# Altium schematic sheet RTM_IPMI.SchDoc: Sayma RTM
size 420 x 297 mm; $$Internal___BlkDate: 23:43:25_12-13-18; $$Internal_NAME_PLACEHOLDER: a3sheet; $$Internal_Resolution: 00001mm; $$NotCommonProperty_@NAME: RTM_IPMI; $$NotCommonProperty_@PRINTORDER: 15; $$NotCommonProperty_@SHEET: 1; $$NotCommonProperty_@SHEETTOTAL: 16; CmpIndex: 4; Drawing Author: G.Kasprowicz; Drawing Number: Sayma RTM; Drawing Project: 8 channel SAWG; Drawing Revision: 2.0; SymIndex: 2227; Author: G.Kasprowicz; CompanyName: WUT ISE; DrawnBy: G.Kasprowicz; Organization: WUT ISE; Address1: PW ISE; Address2: Nowowiejska 15/19 00-665 Warsaw; Address3: gkasprow@gmail.com; DocumentNumber: 17; Revision: 1.0; SheetNumber: 17; SheetTotal: 18; ModifiedBy: -; CheckedDate: -; Title2: RTM IPMI; DivGrp: WUT ISE; Designer: G.Kasprowicz; ModifiedDate: -; ProjectName: Sensor Box
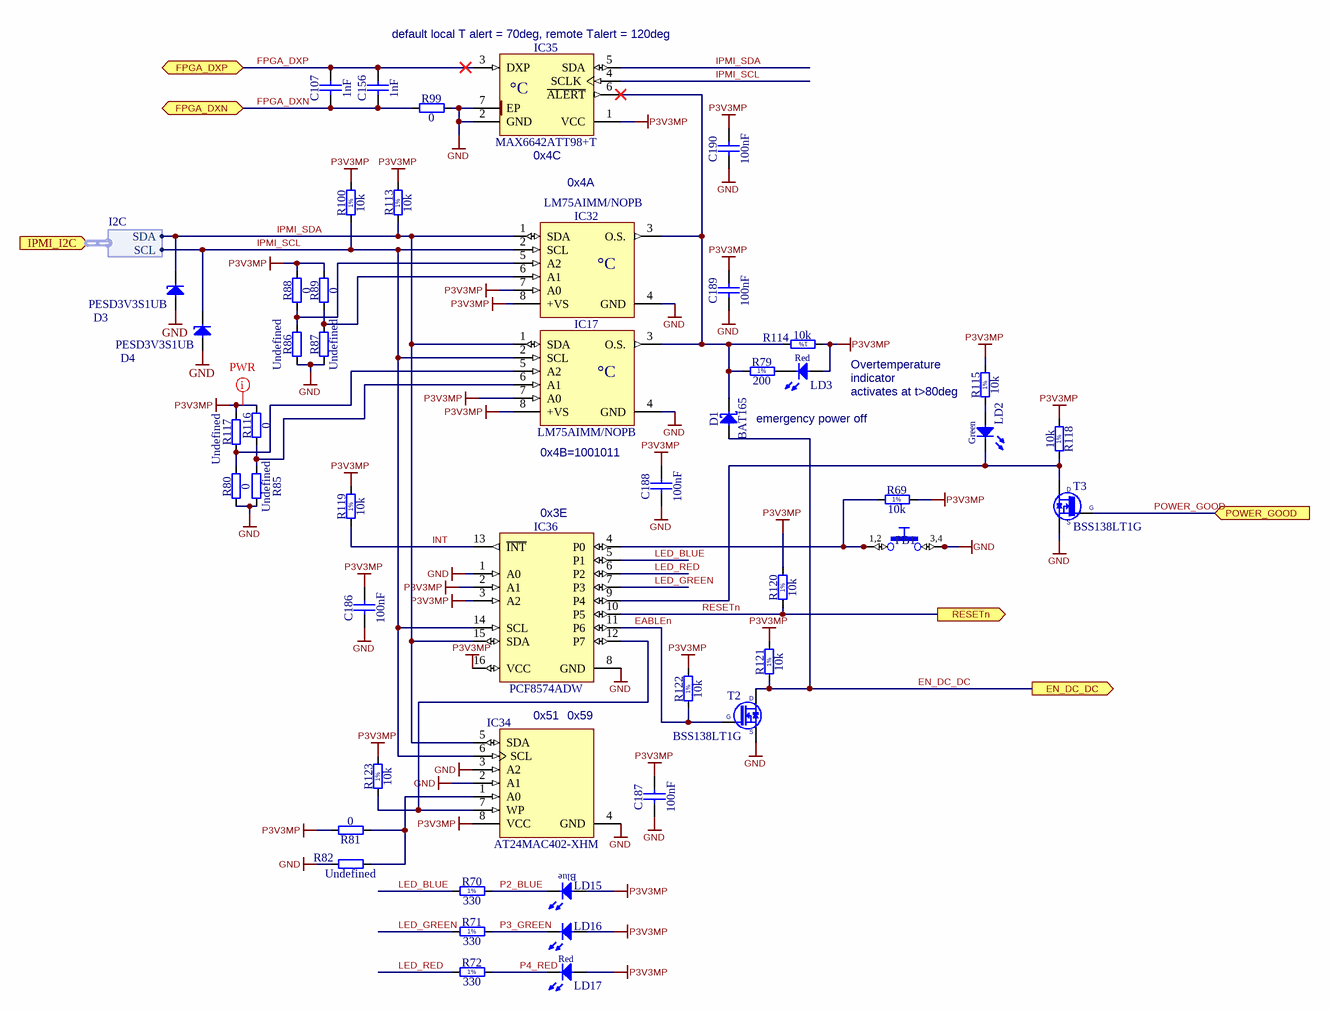
[diagram p0: RTM_IPMI.SchDoc]

## Parts
C107  1nF  [CAPC1005X55N]
C156  1nF  [CAPC1005X55N]
C186  100nF  [CAPC0603X33N]
C187  100nF  [CAPC0603X33N]
C188  100nF  [CAPC0603X33N]
C189  100nF  [CAPC0603X33N]
C190  100nF  [CAPC0603X33N]
D1  BAT165  [SOD2512X110N]
D3  PESD3V3S1UB  [SODFL1608X65N]
D4  PESD3V3S1UB  [SODFL1608X65N]
IC17  LM75AIMM/NOPB  [SOP65P490X109-8N]
IC32  LM75AIMM/NOPB  [SOP65P490X109-8N]
IC34  AT24MAC402-XHM  [SOP65P640X120-8N]
IC35  MAX6642ATT98+T  [SON95P300X300X80-7N-R160X240]
IC36  PCF8574ADW  [SOIC127P1030X265-16N]
LD2  Green  [LED_KINGBRIGHT_KPH-1608CGCK]
LD3  Red  [LED_KINGBRIGHT_KPH-1608SURCK]
LD15  Blue  [LED_AVAGO_HSMR-C120]  (value not drawn)
LD16  Green  [LED_AVAGO_HSME-C120]  (value not drawn)
LD17  Red  [LED_KINGBRIGHT_KPH-1608SURCK]
PB1  Push Button  [SW_C&K_HDT0001]  (value not drawn)
R69  10k  [RESC1005X40N]
R70  330  [RESC1005X40N]
R71  330  [RESC1005X40N]
R72  330  [RESC1005X40N]
R79  200  [RESC1005X40N]
R80  0  [RESC1005X40N]
R81  0  [RESC1005X40N]
R82  Undefined  [RESC1005X40N]
R85  Undefined  [RESC1005X40N]
R86  Undefined  [RESC1005X40N]
R87  Undefined  [RESC1005X40N]
R88  0  [RESC1005X40N]
R89  0  [RESC1005X40N]
R99  0  [RESC1005X40N]
R100  10k  [RESC1005X40N]
R113  10k  [RESC1005X40N]
R114  10k  [RESC1005X40N]
R115  10k  [RESC1005X40N]
R116  0  [RESC1005X40N]
R117  Undefined  [RESC1005X40N]
R118  10k  [RESC1005X40N]
R119  10k  [RESC1005X40N]
R120  10k  [RESC1005X40N]
R121  10k  [RESC1005X40N]
R122  10k  [RESC1005X40N]
R123  10k  [RESC1005X40N]
T2  BSS138LT1G  [SOT95P240X110-3N]
T3  BSS138LT1G  [SOT95P240X110-3N]

## Ports
EN_DC_DC (out), FPGA_DXN (bidir), FPGA_DXP (bidir), IPMI_I2C (in, harness I2C), POWER_GOOD (in), RESETn (out)

## Harnesses
I2C: SCL, SDA

## Nets
GND: C186.1 C187.1 C188.1 C189.1 C190.1 D3.2(A) D4.2(A) IC17.4(GND) IC32.4(GND) IC34.2(A1) IC34.3(A2) IC34.4(GND) IC35.2(GND) IC35.7(EP) IC36.1(A0) IC36.8(GND) PB1.3 PB1.4 R80.1 R82.1 R85.1 R86.1 R87.1 R99.2 T2.2(S) T3.2(S)
P3V3MP: C186.2 C187.2 C188.2 C189.2 C190.2 IC17.7(A0) IC17.8(+VS) IC32.7(A0) IC32.8(+VS) IC34.8(VCC) IC35.1(VCC) IC36.2(A1) IC36.3(A2) IC36.16(VCC) LD3.2(A) LD15.2(A) LD16.2(A) LD17.2(A) R69.2 R81.2 R88.2 R89.2 R100.2 R113.2 R114.1 R115.2 R116.2 R117.2 R118.2 R119.2 R120.2 R121.2 R122.2 R123.2
EABLEn: IC36.11(P6) R122.1 T2.1(G)
EN_DC_DC: D1.2(A) R121.1 T2.3(D) ; port EN_DC_DC
FPGA_DXN: C107.1 C156.1 R99.1 ; port FPGA_DXN
FPGA_DXP: C107.2 C156.2 IC35.3(DXP) ; port FPGA_DXP
INT: IC36.13(~{INT}) R119.1
IPMI_SCL: D4.1(C) IC17.2(SCL) IC32.2(SCL) IC34.6(SCL) IC35.4(SCLK) IC36.14(SCL) R100.1 ; port IPMI_I2C.SCL
IPMI_SDA: D3.1(C) IC17.1(SDA) IC32.1(SDA) IC34.5(SDA) IC35.5(SDA) IC36.15(SDA) R113.1 ; port IPMI_I2C.SDA
LED_BLUE: IC36.5(P1) R70.1
LED_GREEN: IC36.7(P3) R71.1
LED_RED: IC36.6(P2) R72.1
P2_BLUE: LD15.1(C) R70.2
P3_GREEN: LD16.1(C) R71.2
P4_RED: LD17.1(C) R72.2
POWER_GOOD: T3.1(G) ; port POWER_GOOD
RESETn: IC36.10(P5) R120.1 ; port RESETn
NetD1_1: D1.1(C) IC17.3(O.S.) IC32.3(O.S.) IC35.6(~{ALERT}) R79.1 R114.2
NetIC17_5: IC17.5(A2) R80.2 R117.1
NetIC17_6: IC17.6(A1) R85.2 R116.1
NetIC32_5: IC32.5(A2) R86.2 R88.1
NetIC32_6: IC32.6(A1) R87.2 R89.1
NetIC34_1: IC34.1(A0) R81.1 R82.2
NetIC34_7: IC34.7(WP) IC36.12(P7) R123.1
NetIC36_4: IC36.4(P0) PB1.1 PB1.2 R69.1
NetIC36_9: IC36.9(P4) LD2.1(C) R118.1 T3.3(D)
NetLD2_2: LD2.2(A) R115.1
NetLD3_1: LD3.1(C) R79.2

## Layout directives
net class PWR: P3V3MP

## Notes on the sheet
- default local T alert = 70deg, remote Talert = 120deg
- (near IC35) 0x4C
- 0x4A
- Overtemperature
- indicator
- 0x4B=1001011
- emergency power off
- (near R115) activates at t>80deg
- (near IC36) 0x3E
- (near IC34) 0x51
- (near IC34) 0x59
- Project/Equipment
- Document
- Designer
- Drawn by
- Check.by
- Copyright WUT ISE 2018.
  This documentation describes Open Hardware and is licensed under the CERN OHL v.1.1. You may redistribute and modify this documentation under the terms of the CERN OHL v.1.1. (http://ohwr.org/CERNOHL). This documentation is distributed WITHOUT ANY EXPRESS OR IMPLIED WARRANTY, INCLUDING OF MERCHANTABILITY, SATISFACTORY QUALITY AND FITNESS FOR A PARTICULAR PURPOSE. Please see the CERN OHL v.1.1 for applicable conditions.
- Contact
- File
- Last Mod.
- Print Date
- Sheet
- Size
- A3
- of
- Rev
- (in symbol LM75AIMM/NOPB) °C
- (in symbol MAX6642ATT98+T) °C
- (in symbol R0402_10K_1%_0.0625W_100PPM) 1%
- (in symbol R0402_200R_1%_0.0625W_100PPM) 1%
- (in symbol R0402_330R_1%_0.0625W_100PPM) 1%
- (in symbol SW_C&K_HDT0001) 1,2; 3,4

## Library data of the parts
C107 C156 = CC0402_1NF_50V_10%_X7R: Non-polarised capacitor; Manufacturer: GENERIC; Part Description: SMD Multilayer Chip Ceramic Capacitor; Manufacturer1 Part Number: 223858715623; Tolerance: ±10%; Voltage: 50V; TC: X7R; Manufacturer Part Number: CC0402_1NF_50V_10%_X7R; Part Number: CC0402_1NF_50V_10%_X7R; Value: 1nF; Component Kind: Standard; Component Type: Standard; Pin Count: 2; Status: Not Recommended; Case: 0402; Mounted: Yes; Socket: No; SMD: Yes; Sense: No; Manufacturer1 Example: PHYCOMP; Manufacturer1 ComponentHeight: 0.55mm; HelpURL: \\cern.ch\dfs\Applications\Altium\Datasheets\CC0402_X7R_PHYCOMP.pdf; Author: CERN DEM JLC; CreateDate: 03.12.2007; LatestRevisionDate: 03.12.2007
C186-C190 = CC0201_100NF_6.3V_10%_X5R: Non-polarised capacitor; Manufacturer: GENERIC; Manufacturer1 Part Number: 02016D104KAT2A; Part Description: SMD Multilayer Chip Ceramic Capacitor; TC: X5R; Tolerance: ±10%; Voltage: 6.3V; Case: 0201; Manufacturer Part Number: CC0201_100NF_6.3V_10%_X5R; Manufacturer1 Example: AVX; Part Number: CC0201_100NF_6.3V_10%_X5R; Pin Count: 2; SMD: Yes; Status: Not Recommended; Value: 100nF; Component Kind: Standard; Component Type: Standard; Mounted: Yes; Socket: No; Sense: No; Manufacturer1 ComponentHeight: 0.33mm; HelpURL: \\cern.ch\dfs\Applications\Altium\Datasheets\CC0201_X5R_AVX.pdf; Author: CERN DEM JLC; CreateDate: 03.12.2007; LatestRevisionDate: 03.12.2007
D1 = BAT165: Schottky Diode; Manufacturer: INFINEON; Part Description: Medium Power AF Schottky Diode; Bonding: No; Power: 750mA; PressFit: No; Voltage: 40V; Case: SOD323; ComponentHeight: 1.1mm; Device: BAT165; Manufacturer Part Number: BAT165; Mounted: Yes; PackageDescription: Small Outline Diode (SOD-323), 1.70mm W X 1.25mm L X 1.10mm H body,  IPC Medium Density; Part Number: BAT165; Pin Count: 2; Sense: No; SMD: Yes; Socket: No; Component Kind: Standard; Component Type: Standard; HelpURL: \\cern.ch\dfs\Applications\Altium\Datasheets\BAT165.pdf; Author: CERN DEM JLC; CreateDate: 12.11.2014; LatestRevisionDate: 12.11.2014
D3 D4 = PESD3V3S1UB: ESD protection diode; Manufacturer: NXP SEMICONDUCTORS; Part Description: ESD protection diode (23kV); Voltage: 3V3; Power: 330W; PressFit: No; Bonding: No; Manufacturer Part Number: PESD3V3S1UB; PackageDescription: Ultra Small Outline Diode Flat Lead (SOD-523), Body; 1.2mm L X 0.8mm W X 0.65mm H, IPC Medium Density; Part Number: PESD3V3S1UB; Component Kind: Standard; Component Type: Standard; Device: PESD3V3S1UB; Pin Count: 2; Case: SOD523; Mounted: Yes; Socket: No; SMD: Yes; Sense: No; ComponentHeight: 0.65mm; HelpURL: \\cern.ch\dfs\Applications\Altium\Datasheets\PESD3V3S1UB.pdf; Author: CERN DEM JLC; CreateDate: 29.11.2012; LatestRevisionDate: 29.11.2012
IC17 IC32 = LM75AIMM/NOPB: Digital Temperature Sensor and Thermal Watchdog with Two-Wire Interface; Manufacturer: TEXAS INSTRUMENTS; Part Description: -25° to +100°C ±2°C Digital Temperature Sensor and Thermal Watchdog with Two-Wire Interface; Bonding: No; PressFit: No; Case: SSOP8; ComponentHeight: 1.09mm; Device: LM75AIMM/NOPB; Manufacturer Part Number: LM75AIMM/NOPB; Mounted: Yes; PackageDescription: SOP, 0.65mm pitch; 8 pin,3.00mm W X 3.00mm L X 1.09mm H bodyI, PC Medium Density; Part Number: LM75AIMM/NOPB; Pin Count: 8; Sense: No; SMD: Yes; Socket: No; Component Kind: Standard; Component Type: Standard; HelpURL: \\cern.ch\dfs\Applications\Altium\Datasheets\LM75AIMM-NOPB.pdf; Author: CERN DEM JLC; CreateDate: 15.10.2012; LatestRevisionDate: 15.10.2012
IC34 = AT24MAC402-XHM: 1.7V to 5.5V, I2C-Compatible (2-wire) 2-Kbit (256 x 8) Serial EEPROM; Manufacturer: ATMEL; Part Description: 1.7V to 5.5V, I2C-Compatible (2-wire) 2-Kbit (256 x 8) Serial EEPROM with a EUI-48 Address; Bonding: No; PressFit: No; Author: CERN DEM MR; Case: TSSOP8; Component Kind: Standard; Component Type: Standard; ComponentHeight: 1.2mm; CreateDate: 09.03.2016; Device: AT24MAC402-XHM; Footprint: SOP65X640X120-8N; HelpURL: \\cern.ch\dfs\Applications\Altium\Datasheets\AT24MAC402-XHM.pdf; LatestRevisionDate: 09.11.2016; Manufacturer Part Number: AT24MAC402-XHM; Mounted: Yes; PackageDescription: SOP, 0.65mm pitch; 8 pin, 4.40mm W X 3.00mm L X 1.20mm H body, IPC Medium Density; Part Number: AT24MAC402-XHM; Pin Count: 8; Sense: No; SMD: Yes; Socket: No
IC35 = MAX6642ATT98+T: ±1°C, SMBus-Compatible Remote/Local Temperature Sensor with Overtemperature Alarm; Manufacturer: MAXIM; Part Description: 0°C to +125°C, ±1°C, SMBus-Compatible Remote/Local Temperature Sensor with Overtemperature Alarm (Address 1001 100); Bonding: No; PressFit: No; Case: SON6; ComponentHeight: 0.8mm; Device: MAX6642ATT98+T; Manufacturer Part Number: MAX6642ATT98+T; Mounted: Yes; PackageDescription: SON, 0.95mm Pitch; 6 Pin, 3.00mm W X 3mm L X 0.80mm H body (w/Thermal Tab 1.6mm x 2.4mm); Part Number: MAX6642ATT98+T; Pin Count: 7; Sense: No; SMD: Yes; Socket: No; Component Kind: Standard; Component Type: Standard; HelpURL: \\cern.ch\dfs\Applications\Altium\Datasheets\MAX6642ATT98+T.pdf; Author: CERN DEM JLC; CreateDate: 26.11.2013; LatestRevisionDate: 26.11.2013
IC36 = PCF8574ADW: Remote 8-bit I/O Expander For I2C Bus; Manufacturer: TEXAS INSTRUMENTS; Bonding: No; PressFit: No; Case: SOIC16W; ComponentHeight: 2.65mm; Device: PCF8574ADW; Manufacturer Part Number: PCF8574ADW; Mounted: Yes; PackageDescription: SOIC 16, Pitch 1.27mm - Body 7.5x10.3mm, IPC Medium Density; Part Description: Remote 8-bit I/O Expander For I2C Bus; Part Number: PCF8574ADW; Pin Count: 16; Sense: No; SMD: Yes; Socket: No; Component Kind: Standard; Component Type: Standard; Author: CERN DEM JLC; HelpURL: \\cern.ch\dfs\Applications\Altium\Datasheets\PCF8574ADW.pdf; CreateDate: 01.11.2012; LatestRevisionDate: 01.11.2012
LD2 = LED_KINGBRIGHT_KPH-1608CGCK: LED Green 1C 2A; Part Description: SMD Green LED, Case 1.6mmX0.8mm(0603), 0.65mm Thickness; Bonding: No; PressFit: No; Author: CERN DEM JLC; Color: Green; Component Kind: Standard; Component Type: Standard; ComponentHeight: 0.65mm; CreateDate: 03.07.2017; HelpURL: \\cern.ch\dfs\Applications\Altium\Datasheets\LED_KINGBRIGHT_KPH-1608CGCK.pdf; LatestRevisionDate: 03.07.2017; Manufacturer Part Number: KPH-1608CGCK; Manufacturer: KINGBRIGHT; Mounted: Yes; PackageDescription: SMT Green LED, Case 0603, Body L 1.6 x W 0.8mm H 0.65mm; Part Number: LED_KINGBRIGHT_KPH-1608CGCK; Pin Count: 2; Sense: No; SMD: Yes; Socket: No
LD3 = LED_KINGBRIGHT_KPH-1608SURCK: LED Red 1C 2A; Part Description: SMD Hyper Red LED, Case 1.6mmX0.8mm(0603), 0.65mm Thickness; Bonding: No; PressFit: No; Author: CERN DEM JLC; Color: Red; Component Kind: Standard; Component Type: Standard; ComponentHeight: 0.65mm; CreateDate: 03.07.2017; HelpURL: \\cern.ch\dfs\Applications\Altium\Datasheets\LED_KINGBRIGHT_KPH-1608SURCK.pdf; LatestRevisionDate: 03.07.2017; Manufacturer Part Number: KPH-1608SURCK; Manufacturer: KINGBRIGHT; Mounted: Yes; PackageDescription: SMT Hyper Red LED, Case 0603, Body L 1.6 x W 0.8mm H 0.65mm; Part Number: LED_KINGBRIGHT_KPH-1608SURCK; Pin Count: 2; Sense: No; SMD: Yes; Socket: No
LD15 = LED_AVAGO_HSMR-C120: LED Blue 1C 2A; Manufacturer: AVAGO TECHNOLOGIES; Part Description: High Performance Right Angle Chip InGaN Blue LED; Bonding: No; PressFit: No; Author: CERN DEM JLC; Color: Blue; Component Kind: Standard; Component Type: Standard; ComponentHeight: 0.7mm; CreateDate: 07.07.2014; HelpURL: \\cern.ch\dfs\Applications\Altium\Datasheets\LED_AVAGO_HSMR-C120.pdf; LatestRevisionDate: 07.07.2014; Manufacturer Part Number: HSMR-C120; Mounted: Yes; PackageDescription: Blue Chip LED, 2-Leads, Body 1.7x1.1mm, Side Emitting Package; Part Number: LED_AVAGO_HSMR-C120; Pin Count: 2; Sense: No; SMD: Yes; Socket: No
LD16 = LED_AVAGO_HSME-C120: LED Green 1C 2A; Manufacturer: AVAGO TECHNOLOGIES; Part Description: High Performance Right Angle Chip Green LED; Bonding: No; PressFit: No; Author: CERN DEM JMW; Color: Green; Component Kind: Standard; Component Type: Standard; ComponentHeight: 0.7mm; CreateDate: 22.07.2009; HelpURL: \\cern.ch\dfs\Applications\Altium\Datasheets\LED_AVAGO_HSME-C120.pdf; LatestRevisionDate: 20.06.2012; Manufacturer Part Number: HSME-C120; Mounted: Yes; PackageDescription: Green Chip LED, 2-Leads, Body 1.7x1.1mm, Side Emitting Package; Part Number: LED_AVAGO_HSME-C120; Pin Count: 2; Sense: No; SMD: Yes; Socket: No; ComponentLink1URL: \\cern.ch\dfs\Applications\Altium\Datasheets\LED_AVAGO_HSME-C110_DESIGN-GUIDE.pdf; ComponentLink1Description: Design Guide
LD17 = LED_KINGBRIGHT_KPH-1608SURCK: LED Red 1C 2A; Part Description: SMD Hyper Red LED, Case 1.6mmX0.8mm(0603), 0.65mm Thickness; PressFit: No; Bonding: No; Part Number: LED_KINGBRIGHT_KPH-1608SURCK; Component Kind: Standard; Component Type: Standard; Color: Red; PackageDescription: SMT Hyper Red LED, Case 0603, Body L 1.6 x W 0.8mm H 0.65mm; Manufacturer: KINGBRIGHT; Manufacturer Part Number: KPH-1608SURCK; Pin Count: 2; Mounted: Yes; Socket: No; SMD: Yes; Sense: No; ComponentHeight: 0.65mm; HelpURL: \\cern.ch\dfs\Applications\Altium\Datasheets\LED_KINGBRIGHT_KPH-1608SURCK.pdf; Author: CERN DEM JLC; CreateDate: 03.07.2017; LatestRevisionDate: 03.07.2017
PB1 = SW_C&K_HDT0001: Push-Button Switch SPDT; Manufacturer: C&K; Part Description: 5VDC 1mA SPST-NO Micro Mini Surface Surface Mount Detect Push-Button Switch, HDT Series; PressFit: No; Author: CERN DEM JLC; Component Kind: Standard; Component Type: Standard; ComponentHeight: 3.35mm; CreateDate: 15.08.2012; Family: Push Button; HelpURL: \\cern.ch\dfs\Applications\Altium\Datasheets\SW_C&K_HDT0001.pdf; LatestRevisionDate: 15.08.2012; Manufacturer Part Number: HDT0001; Mounted: Yes; PackageDescription: Body 3.5x2.8mm, Micro Mini Surface Mount Detect Switches, HDT Serie; Part Number: SW_C&K_HDT0001; Pin Count: 4; Sense: No; SMD: Yes; Socket: No; Status: None
R69 R100 R113-R115 R118-R123 = R0402_10K_1%_0.0625W_100PPM: Resistor - 1%; Manufacturer: GENERIC; Manufacturer1 Part Number: 232270671003L; Part Description: General Purpose Thick Film Chip Resistor; TC: ±100ppm/°C; PressFit: No; Case: 0402; Manufacturer Part Number: R0402_10K_1%_0.0625W_100PPM; Manufacturer1 ComponentHeight: 0.4mm; Manufacturer1 Example: YAGEO PHYCOMP; Part Number: R0402_10K_1%_0.0625W_100PPM; Pin Count: 2; Power: 0.0625W; Sense: No; SMD: Yes; Status: Not Recommended; Tolerance: ±1%; Value: 10k; Component Kind: Standard; Component Type: Standard; Mounted: Yes; Socket: No; HelpURL: \\cern.ch\dfs\Applications\Altium\Datasheets\R0402_Phycomp_RC0402.pdf; Author: CERN DEM JLC; CreateDate: 03.12.2007; LatestRevisionDate: 17.10.2012
R70-R72 = R0402_330R_1%_0.0625W_100PPM: Resistor - 1%; Manufacturer: GENERIC; Manufacturer1 Part Number: 232270673301L; Part Description: General Purpose Thick Film Chip Resistor; TC: ±100ppm/°C; PressFit: No; Case: 0402; Manufacturer Part Number: R0402_330R_1%_0.0625W_100PPM; Manufacturer1 ComponentHeight: 0.4mm; Manufacturer1 Example: YAGEO PHYCOMP; Part Number: R0402_330R_1%_0.0625W_100PPM; Pin Count: 2; Power: 0.0625W; Sense: No; SMD: Yes; Status: Not Recommended; Tolerance: ±1%; Value: 330; Component Kind: Standard; Component Type: Standard; Mounted: Yes; Socket: No; HelpURL: \\cern.ch\dfs\Applications\Altium\Datasheets\R0402_Phycomp_RC0402.pdf; Author: CERN DEM JLC; CreateDate: 03.12.2007; LatestRevisionDate: 17.10.2012
R79 = R0402_200R_1%_0.0625W_100PPM: Resistor - 1%; Manufacturer: GENERIC; Manufacturer1 Part Number: 232270672001L; Part Description: General Purpose Thick Film Chip Resistor; TC: ±100ppm/°C; PressFit: No; Case: 0402; Manufacturer Part Number: R0402_200R_1%_0.0625W_100PPM; Manufacturer1 ComponentHeight: 0.4mm; Manufacturer1 Example: YAGEO PHYCOMP; Part Number: R0402_200R_1%_0.0625W_100PPM; Pin Count: 2; Power: 0.0625W; Sense: No; SMD: Yes; Status: Not Recommended; Tolerance: ±1%; Value: 200; Component Kind: Standard; Component Type: Standard; Mounted: Yes; Socket: No; HelpURL: \\cern.ch\dfs\Applications\Altium\Datasheets\R0402_Phycomp_RC0402.pdf; Author: CERN DEM JLC; CreateDate: 03.12.2007; LatestRevisionDate: 17.10.2012
R80 R81 R88 R89 R99 R116 = R0402_0R_JUMPER: Resistor; Manufacturer: GENERIC; Manufacturer1 Part Number: 232270591001L; Part Description: 1A (0.05R Max DC Resistance) Zero Ohm Jumper; PressFit: No; Case: 0402; Manufacturer Part Number: R0402_0R_JUMPER; Manufacturer1 ComponentHeight: 0.4mm; Manufacturer1 Example: YAGEO PHYCOMP; Part Number: R0402_0R_JUMPER; Pin Count: 2; Sense: No; SMD: Yes; Status: Not Recommended; Value: 0; Component Kind: Standard; Component Type: Standard; Mounted: Yes; Socket: No; HelpURL: \\cern.ch\dfs\Applications\Altium\Datasheets\R0402_Phycomp_RC0402.pdf; Author: CERN DEM JLC; CreateDate: 03.12.2007; LatestRevisionDate: 17.10.2012
R82 R85-R87 R117 = R0402_NO-VALUE: Resistor; Part Description: Reserved Footprint For a 0402 (1005) Chip Resistor; PressFit: No; Mounted: No; Case: 0402; Manufacturer Part Number: R0402_NO-VALUE; Manufacturer: Undefined; Manufacturer1 ComponentHeight: Undefined; Manufacturer1 Example: Undefined; Manufacturer1 Part Number: Undefined; Part Number: R0402_NO-VALUE; Pin Count: 2; Sense: No; SMD: Yes; Status: None; Value: Undefined; Component Kind: Standard; Component Type: Standard; Socket: No; HelpURL: Undefined; Author: CERN DEM JLC; CreateDate: 03.12.2007; LatestRevisionDate: 13.03.2008
T2 T3 = BSS138LT1G: N-CHANNEL MOSFET WITH DIODE; Manufacturer: ON SEMICONDUCTOR; Part Description: 50V 200mA N-Channel Enhancement Mode Field-Effect Transistor; Bonding: No; PressFit: No; Case: SOT23-3; ComponentHeight: 1.11mm; Device: BSS138LT1G; Manufacturer Part Number: BSS138LT1G; Mounted: Yes; PackageDescription: SOT23 3-Leads, Pitch 0.95mm - Body 1.4x3mm, IPC Medium Density; Part Number: BSS138LT1G; Pin Count: 3; Sense: No; SMD: Yes; Socket: No; Component Kind: Standard; Component Type: Standard; HelpURL: \\cern.ch\dfs\Applications\Altium\Datasheets\BSS138LT1G.pdf; Author: CERN DEM JLC; CreateDate: 23.03.2009; LatestRevisionDate: 23.03.2009